# Altium project PCB_Project.PrjPcb (part 1 of 3)
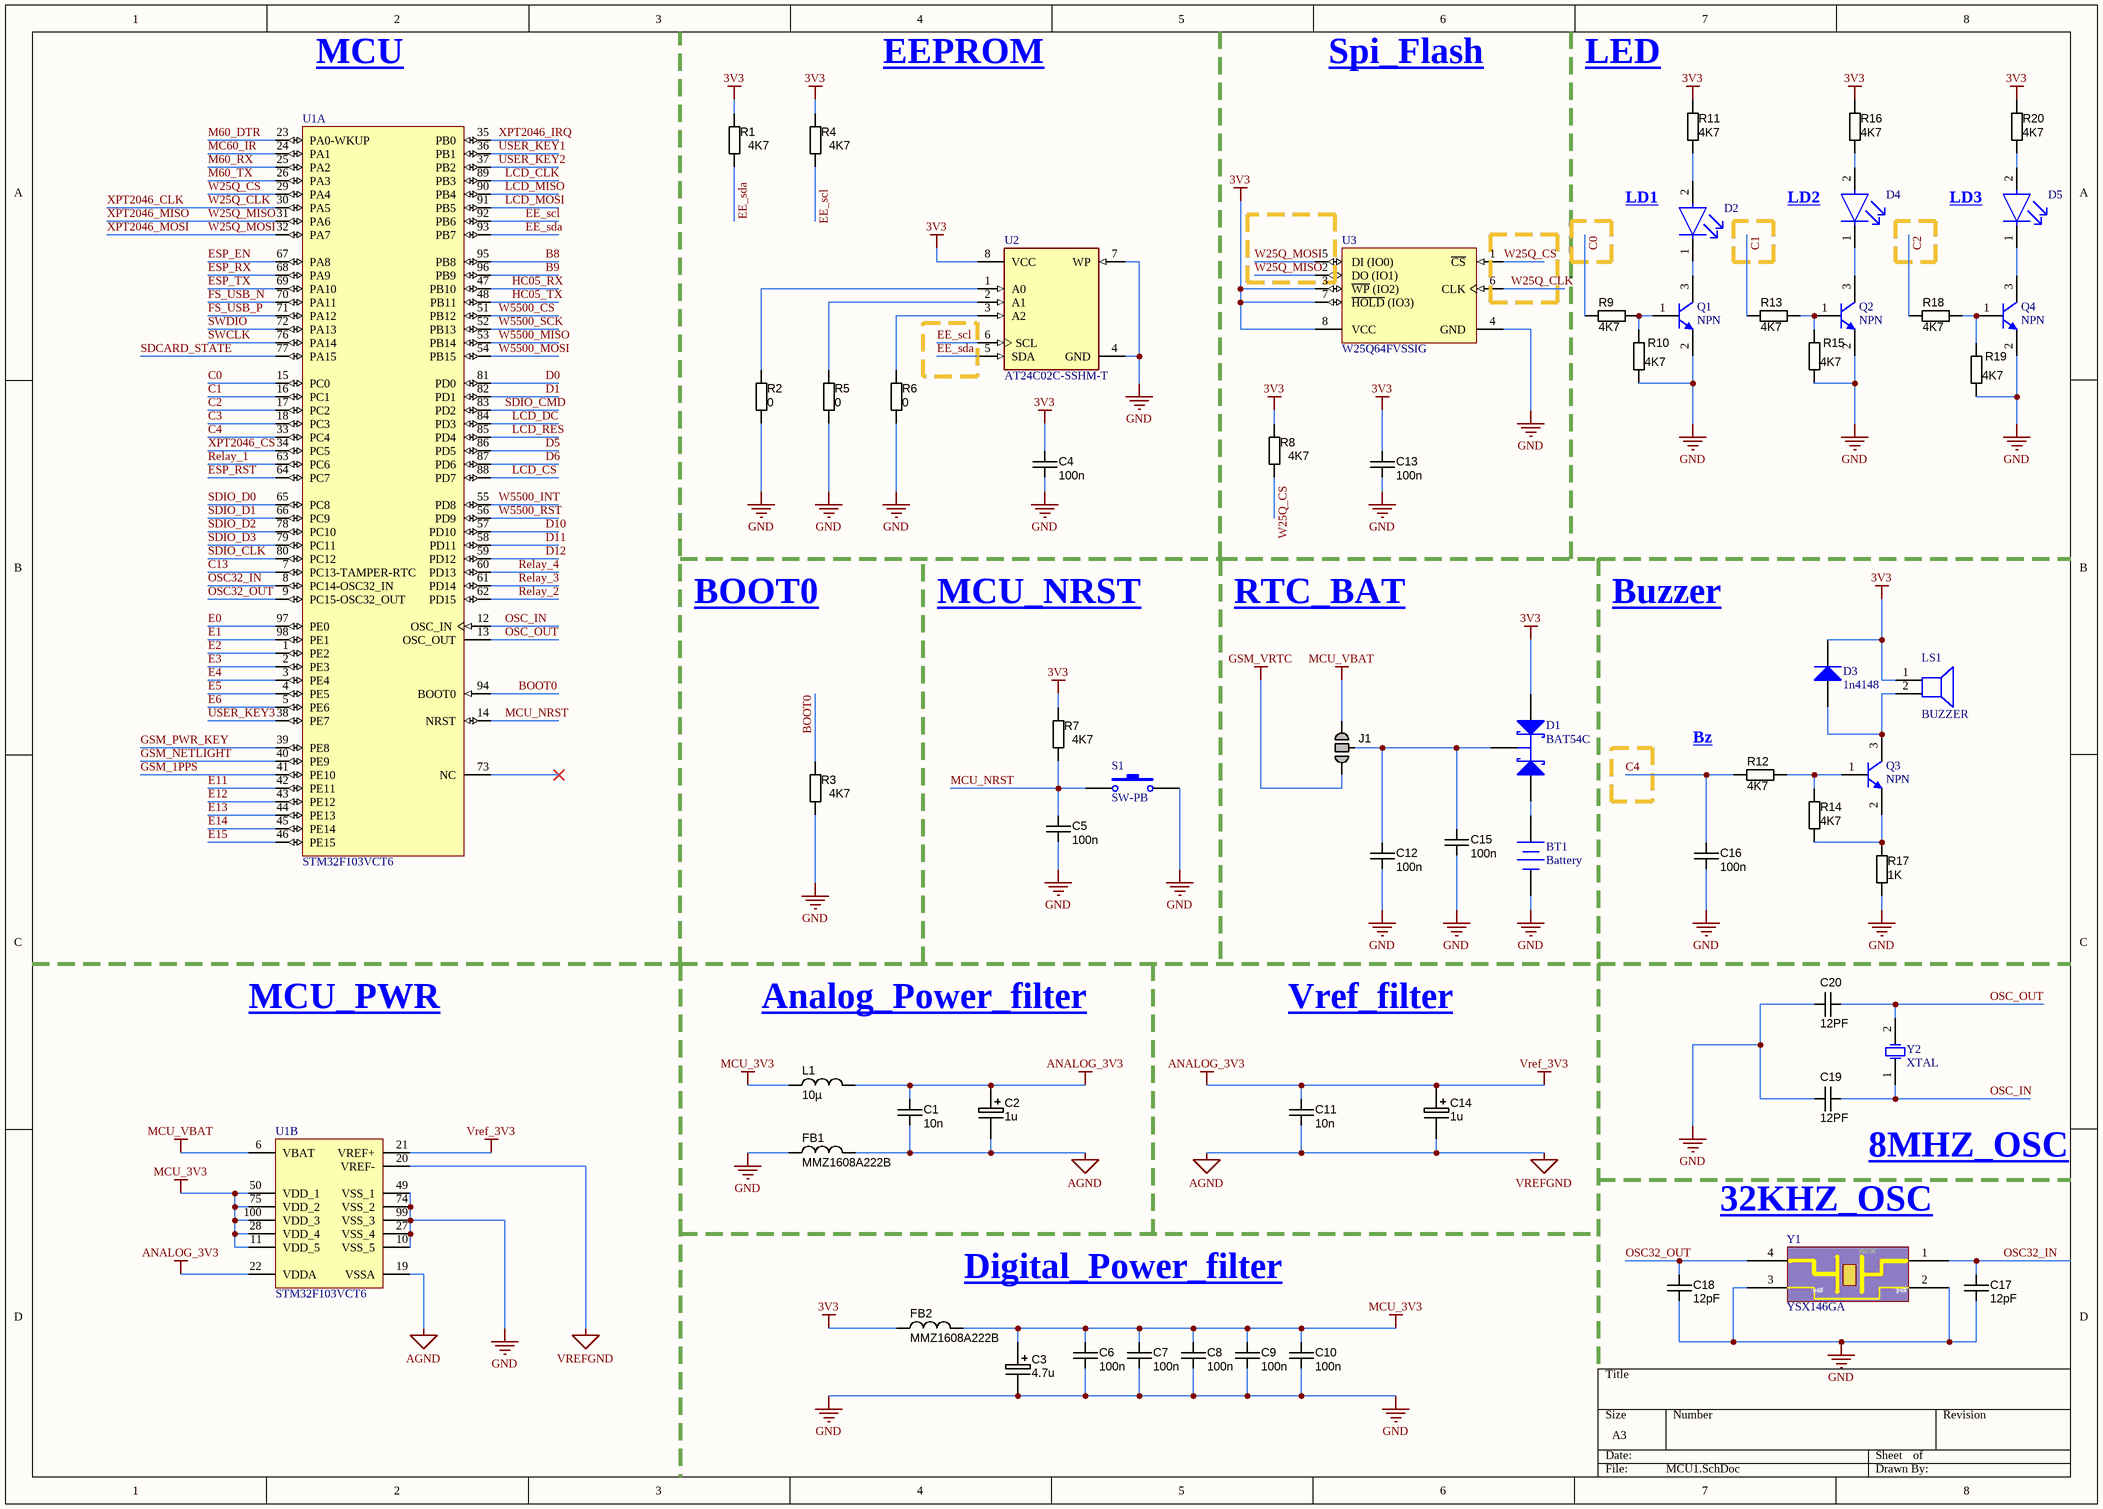
[diagram p0: MCU1.SchDoc]
8 sheets, 365 parts. Net scope: global (net labels, ports and power ports of the same name join across sheets).
Board file: iot_board_pcb.PcbDoc
Sheets:
  MCU1.SchDoc
  Wifi.SchDoc
  W5500.SchDoc
  MCU3.SchDoc
  MC60.SchDoc
  Power.SchDoc
  MCU4.SchDoc
  MCU2.SchDoc

## Sheet MCU1.SchDoc: "mahdi"
size A3; Date: 19/6/1400; SheetNumber: 1; SheetTotal: 8

### Parts
BT1  Battery  [BTH1220]
C1  value 10n  [CAPC1608X90N]  (hidden comment: approved sub OK)
C2  value 1u  [C_TN_3216]
C3  value 4.7u  [C_TN_3528]
C4  value 100n  [CAPC1608X90N]  (hidden comment: approved sub OK)
C5  value 100n  [CAPC1608X90N]  (hidden comment: approved sub OK)
C6  value 100n  [CAPC1608X90N]  (hidden comment: approved sub OK)
C7  value 100n  [CAPC1608X90N]  (hidden comment: approved sub OK)
C8  value 100n  [CAPC1608X90N]  (hidden comment: approved sub OK)
C9  value 100n  [CAPC1608X90N]  (hidden comment: approved sub OK)
C10  value 100n  [CAPC1608X90N]  (hidden comment: approved sub OK)
C11  value 10n  [CAPC1608X90N]  (hidden comment: approved sub OK)
C12  value 100n  [CAPC1608X90N]  (hidden comment: approved sub OK)
C13  value 100n  [CAPC1608X90N]  (hidden comment: approved sub OK)
C14  value 1u  [C_TN_3216]
C15  value 100n  [C1206]  (hidden comment: approved sub OK)
C16  value 100n  [CAPC1608X90N]  (hidden comment: approved sub OK)
C17  value 12pF  [CAPC1608X90N]  (hidden comment: approved sub OK)
C18  value 12pF  [CAPC1608X90N]  (hidden comment: approved sub OK)
C19  value 12PF  [CAPC1608X90N]  (hidden comment: approved sub OK)
C20  value 12PF  [CAPC1608X90N]  (hidden comment: approved sub OK)
D1  BAT54C  [NXP-SOT23-3_V]
D2  LTST-C191TBKT  [FP-LTST-C191TBKT-MFG]  (value not drawn)
D3  1n4148  [d_sod80]
D4  LTST-C191TBKT  [FP-LTST-C191TBKT-MFG]  (value not drawn)
D5  LTST-C191TBKT  [FP-LTST-C191TBKT-MFG]  (value not drawn)
FB1  Manufacturer Part Number 1: MMZ1608A222B  [FBC1608X95N]  (hidden comment: 2K2 @ 100 MHz)
FB2  Manufacturer Part Number 1: MMZ1608A222B  [FBC1608X95N]  (hidden comment: 2K2 @ 100 MHz)
J1  Jumper  [Jump_3Way]  (value not drawn)  (no BOM)
L1  10µ  [INDC3225X250N]
LS1  BUZZER  [BZ_C12]
Q1  NPN  [SOT23-3]
Q2  NPN  [SOT23-3]
Q3  NPN  [SOT23-3]
Q4  NPN  [SOT23-3]
R1  value 4K7  [RESC1608X55N]  (hidden comment: Thick Film)
R2  value 0  [RESC1608X55N]  (hidden comment: Thick Film)
R3  value 4K7  [RESC1608X55N]  (hidden comment: Thick Film)
R4  value 4K7  [RESC1608X55N]  (hidden comment: Thick Film)
R5  value 0  [RESC1608X55N]  (hidden comment: Thick Film)
R6  value 0  [RESC1608X55N]  (hidden comment: Thick Film)
R7  value 4K7  [RESC1608X55N]  (hidden comment: Thick Film)
R8  value 4K7  [RESC1608X55N]  (hidden comment: Thick Film)
R9  value 4K7  [RESC1608X55N]  (hidden comment: Thick Film)
R10  value 4K7  [RESC1608X55N]  (hidden comment: Thick Film)
R11  value 4K7  [RESC1608X55N]  (hidden comment: Thick Film)
R12  value 4K7  [RESC1608X55N]  (hidden comment: Thick Film)
R13  value 4K7  [RESC1608X55N]  (hidden comment: Thick Film)
R14  value 4K7  [RESC1608X55N]  (hidden comment: Thick Film)
R15  value 4K7  [RESC1608X55N]  (hidden comment: Thick Film)
R16  value 4K7  [RESC1608X55N]  (hidden comment: Thick Film)
R17  value 1K  [RESC1608X55N]  (hidden comment: Thick Film)
R18  value 4K7  [RESC1608X55N]  (hidden comment: Thick Film)
R19  value 4K7  [RESC1608X55N]  (hidden comment: Thick Film)
R20  value 4K7  [RESC1608X55N]  (hidden comment: Thick Film)
S1  SW-PB  [SWPBS_SPST_6X3X5]
U1  STM32F103VCT6  [STM-LQFP100_L]  (parts A,B of 2)
U2  AT24C02C-SSHM-T  [FP-C04-057-SN-MFG]
U3  W25Q64FVSSIG  [WINB-SOIC-8_M]
Y1  YSX146GA  [YSX146GA-32.768xTAL]
Y2  XTAL  [XTL_2_5032]

### Nets
3V3: C4.1 C13.1 D1.2(A) D3.2(K) FB2.1 LS1.1 R1.1 R4.1 R7.1 R8.1 R11.2 R16.2 R20.2 U2.8(VCC) U3.3(~{WP}_(IO2)) U3.7(~{HOLD}_(IO3)) U3.8(VCC)
AGND: C1.2 C2.2 C11.2 C14.2 FB1.2 U1.19(VSSA) U1.20(VREF-)  [also labelled VREFGND]
ANALOG_3V3: C1.1 C2.1 C11.1 C14.1 L1.2 U1.21(VREF+) U1.22(VDDA)  [also labelled Vref_3V3]
GND: BT1.2(-) C3.2 C4.2 C5.2 C6.2 C7.2 C8.2 C9.2 C10.2 C12.2 C13.2 C15.2 C16.2 C17.1 C18.1 C19.1 C20.1 FB1.1 Q1.2(E) Q2.2(E) Q4.2(E) R2.1 R3.2 R5.1 R6.1 R10.1 R15.1 R17.2 R19.1 S1.2 U1.10(VSS_5) U1.27(VSS_4) U1.49(VSS_1) U1.74(VSS_2) U1.99(VSS_3) U2.4(GND) U2.7(WP) U3.4(GND) Y1.2 Y1.3
GSM_VRTC: J1.1
MCU_3V3: C3.1 C6.1 C7.1 C8.1 C9.1 C10.1 FB2.2 L1.1 U1.11(VDD_5) U1.28(VDD_4) U1.50(VDD_1) U1.75(VDD_2) U1.100(VDD_3)
MCU_VBAT: J1.3 U1.6(VBAT)
B8: U1.95(PB8)
B9: U1.96(PB9)
BOOT0: R3.1 U1.94(BOOT0)
C0: R9.1 U1.15(PC0)
C1: R13.1 U1.16(PC1)
C2: R18.1 U1.17(PC2)
C3: U1.18(PC3)
C4: C16.1 R12.1 U1.33(PC4)
C13: U1.7(PC13-TAMPER-RTC)
D0: U1.81(PD0)
D1: U1.82(PD1)
D5: U1.86(PD5)
D6: U1.87(PD6)
D10: U1.57(PD10)
D11: U1.58(PD11)
D12: U1.59(PD12)
E0: U1.97(PE0)
E1: U1.98(PE1)
E2: U1.1(PE2)
E3: U1.2(PE3)
E4: U1.3(PE4)
E5: U1.4(PE5)
E6: U1.5(PE6)
E11: U1.42(PE11)
E12: U1.43(PE12)
E13: U1.44(PE13)
E14: U1.45(PE14)
E15: U1.46(PE15)
EE_scl: R4.2 U1.92(PB6) U2.6(SCL)
EE_sda: R1.2 U1.93(PB7) U2.5(SDA)
ESP_EN: U1.67(PA8)
ESP_RST: U1.64(PC7)
ESP_RX: U1.68(PA9)
ESP_TX: U1.69(PA10)
FS_USB_N: U1.70(PA11)
FS_USB_P: U1.71(PA12)
GSM_1PPS: U1.41(PE10)
GSM_NETLIGHT: U1.40(PE9)
GSM_PWR_KEY: U1.39(PE8)
HC05_RX: U1.47(PB10)
HC05_TX: U1.48(PB11)
LCD_CLK: U1.89(PB3)
LCD_CS: U1.88(PD7)
LCD_DC: U1.84(PD3)
LCD_MISO: U1.90(PB4)
LCD_MOSI: U1.91(PB5)
LCD_RES: U1.85(PD4)
M60_DTR: U1.23(PA0-WKUP)
M60_RX: U1.25(PA2)
M60_TX: U1.26(PA3)
MC60_IR: U1.24(PA1)
MCU_NRST: C5.1 R7.2 S1.1 U1.14(NRST)
OSC32_IN: C17.2 U1.8(PC14-OSC32_IN) Y1.1
OSC32_OUT: C18.2 U1.9(PC15-OSC32_OUT) Y1.4
OSC_IN: C19.2 U1.12(OSC_IN) Y2.1(OSC1)
OSC_OUT: C20.2 U1.13(OSC_OUT) Y2.2(OSC2)
Relay_1: U1.63(PC6)
Relay_2: U1.62(PD15)
Relay_3: U1.61(PD14)
Relay_4: U1.60(PD13)
SDCARD_STATE: U1.77(PA15)
SDIO_CLK: U1.80(PC12)
SDIO_CMD: U1.83(PD2)
SDIO_D0: U1.65(PC8)
SDIO_D1: U1.66(PC9)
SDIO_D2: U1.78(PC10)
SDIO_D3: U1.79(PC11)
SWCLK: U1.76(PA14)
SWDIO: U1.72(PA13)
USER_KEY1: U1.36(PB1)
USER_KEY2: U1.37(PB2)
USER_KEY3: U1.38(PE7)
W25Q_CLK: U1.30(PA5) U3.6(CLK)  [also labelled XPT2046_CLK]
W25Q_CS: R8.2 U1.29(PA4) U3.1(~{CS})
W25Q_MISO: U1.31(PA6) U3.2(DO_(IO1))  [also labelled XPT2046_MISO]
W25Q_MOSI: U1.32(PA7) U3.5(DI_(IO0))  [also labelled XPT2046_MOSI]
W5500_CS: U1.51(PB12)
W5500_INT: U1.55(PD8)
W5500_MISO: U1.53(PB14)
W5500_MOSI: U1.54(PB15)
W5500_RST: U1.56(PD9)
W5500_SCK: U1.52(PB13)
XPT2046_CS: U1.34(PC5)
XPT2046_IRQ: U1.35(PB0)
NetBT1_1: BT1.1(+) D1.1(A)
NetC12_1: C12.1 C15.1 D1.3(K) J1.2
NetD2_1: D2.1(C) Q1.3(C)
NetD2_2: D2.2(A) R11.1
NetD3_1: D3.1(A) LS1.2 Q3.3(C)
NetD4_1: D4.1(C) Q2.3(C)
NetD4_2: D4.2(A) R16.1
NetD5_1: D5.1(C) Q4.3(C)
NetD5_2: D5.2(A) R20.1
NetQ1_1: Q1.1(B) R9.2 R10.2
NetQ2_1: Q2.1(B) R13.2 R15.2
NetQ3_1: Q3.1(B) R12.2 R14.2
NetQ3_2: Q3.2(E) R14.1 R17.1
NetQ4_1: Q4.1(B) R18.2 R19.2
NetR2_2: R2.2 U2.1(A0)
NetR5_2: R5.2 U2.2(A1)
NetR6_2: R6.2 U2.3(A2)

Not connected (* = marked no-connect by the designer): U1 73(NC)*

### Notes on the sheet
- MCU
- EEPROM
- Spi_Flash
- LED
- LD1
- LD2
- LD3
- BOOT0
- MCU_NRST
- RTC_BAT
- Buzzer
- (near R12) Bz
- MCU_PWR
- Analog_Power_filter
- Vref_filter
- 8MHZ_OSC
- (near Y1) 32KHZ_OSC
- Digital_Power_filter
- (in symbol YSX146GA) 32.768; gnd

### Library data of the parts
BT1 = Battery: Multicell Battery; Published: 24-Mar-1999; LatestRevisionDate: 17-Jul-2002; LatestRevisionNote: Re-released for DXP Platform.; PackageReference: BAT-2; Publisher: Altium Limited; PackageDescription: Battery; 2 Leads
C1 C4-C13 C15 C16 = CAPC_100n_0603_X7R_50V_10%: Capacitor SMD Cer 100nF 10% 50V X7R 0603; Manufacturer 1: AVX Corporation; Manufacturer Part Number 1: 06035C104KAT2A; Ratings: 50V; X7R; Material: ceramic; SCDType: spec; Manufacturer 2: TDK Corporation; Manufacturer Part Number 2: C1608X7R1H104K; Package / Case: 0603 (1608 Metric); Tolerance: ±10%; Supplier 1: Digi-Key; Supplier Part Number 1: 478-5052-1-ND; ComponentLink1URL: http://www.avx.com/docs/Catalogs/cx7r.pdf; ComponentLink1Description: http://www.avx.com/docs/Catalogs/cx7r.pdf; Supplier 2: Digi-Key; Supplier Part Number 2: 445-1314-1-ND; ComponentLink2URL: http://product.tdk.com/capacitor/mlcc/en/documents/mlcc_commercial_general_en.pdf; ComponentLink2Description: http://product.tdk.com/capacitor/mlcc/en/documents/mlcc_commercial_general_en.pdf
C2 C3 C14 = CAPT_4u7_3216_16V: Capacitor SMD Tantalum 10uF 10% 16V 3216-18; Manufacturer 1: Vishay/Sprague; Manufacturer Part Number 1: 293D475X9016A2TE3; SCDType: undef; Package / Case: EIA 535BAAC size A; Ratings: 16V; Tolerance: ±10%; Material: Tantalum; Supplier 1: Digi-Key; Supplier Part Number 1: 718-1148-1-ND
C17 C18 = CAPC_100n_0603_X7R_50V_10%: Capacitor SMD Cer 6.8PF 10% 50V X7R 0603; Manufacturer 1: AVX Corporation; Manufacturer Part Number 1: 06035C104KAT2A; Ratings: 50V; X7R; Material: ceramic; SCDType: spec; Manufacturer 2: TDK Corporation; Manufacturer Part Number 2: C1608X7R1H104K; Package / Case: 0603 (1608 Metric); Tolerance: ±10%; Supplier 1: Digi-Key; Supplier Part Number 1: 478-5052-1-ND; ComponentLink1URL: http://www.avx.com/docs/Catalogs/cx7r.pdf; ComponentLink1Description: http://www.avx.com/docs/Catalogs/cx7r.pdf; Supplier 2: Digi-Key; Supplier Part Number 2: 445-1314-1-ND; ComponentLink2URL: http://product.tdk.com/capacitor/mlcc/en/documents/mlcc_commercial_general_en.pdf; ComponentLink2Description: http://product.tdk.com/capacitor/mlcc/en/documents/mlcc_commercial_general_en.pdf
C19 C20 = CAPC_100n_0603_X7R_50V_10%: Capacitor SMD Cer 20PF10% 50V X7R 0603; Manufacturer 1: AVX Corporation; Manufacturer Part Number 1: 06035C104KAT2A; Tolerance: ±10%; Ratings: 50V; X7R; Material: ceramic; SCDType: spec; Manufacturer 2: TDK Corporation; Manufacturer Part Number 2: C1608X7R1H104K; Package / Case: 0603 (1608 Metric); Supplier 1: Digi-Key; Supplier Part Number 1: 478-5052-1-ND; ComponentLink1URL: http://www.avx.com/docs/Catalogs/cx7r.pdf; ComponentLink1Description: http://www.avx.com/docs/Catalogs/cx7r.pdf; Supplier 2: Digi-Key; Supplier Part Number 2: 445-1314-1-ND; ComponentLink2URL: http://product.tdk.com/capacitor/mlcc/en/documents/mlcc_commercial_general_en.pdf; ComponentLink2Description: http://product.tdk.com/capacitor/mlcc/en/documents/mlcc_commercial_general_en.pdf
D1 = CMP-0417-00003-1: Schottky Barrier Diode, 30 V, 2 uA, -55 to 150 degC, 3-Pin SOT23, RoHS, Tape and Reel; Manufacturer: NXP Semiconductors; IR (uA): 2; VF (mV): 800; Trr (ns): 5; Cd (pF): 10; VR (V): 30; Rth(j-a) (K/W): 500; RoHS: TRUE; Packing: Tape and Reel; ComponentLink2URL: http://www.nxp.com/documents/data_sheet/BAT54_SER.pdf; PartNumber: BAT54C; ComponentLink2Description: Datasheet; Temperature Range: -55 to 150 degC; PackageReference: SOT23-3; PackageDescription: 3-Pin Plastic Surface-mounted Package, Body 1.3 x 2.9 mm, Pitch 0.95 mm; Mounting Technology: Surface Mount; ComponentLink1URL: http://www.nxp.com/; DatasheetVersion: Rev. 5; ComponentLink1Description: Manufacturer URL
D2 D4 D5 = CMP-22017-000008-1: LED BLUE CLEAR CHIP SMD; Lens Color: Colorless; Dominant Wavelength: 475nm; Forward Current: 20mA; Wavelength: 468nm; Viewing Angle: 130°; Power Dissipation: 76mW; Luminous Intensity: 180mcd; Reverse Voltage: 5V; Number of Elements: 1; Lens Style: Diffused; Forward Voltage: 3.8V; Max Power Dissipation: 75mW; Case Code (Metric): 1608; Packaging: Tape and Reel; Case/Package: 0603; Depth: 1.6mm; Mount: Surface Mount; Lead Free: Lead Free; Min Operating Temperature: -20°C; Lens Transparency: Clear; Illumination Color: Blue; Height: 0.55mm; Test Current: 20mA; Case Code (Imperial): 0603; Max Operating Temperature: 80°C; Number of Pins: 2; Length: 0.8mm; Radiation Hardening: No; Package Quantity: 1; Number of LEDs: 1; Width: 0.8mm; Color: Blue
D3 = Diode: Default Diode; Published: 8-Jun-2000; LatestRevisionDate: 17-Jul-2002; LatestRevisionNote: Re-released for DXP Platform.; PackageVersion: Sep-1996; PackageReference: SMC; Publisher: Altium Limited; PackageDescription: DO-214-AB/SMC; 2 C-Bend Leads; Body 7.9 x 5.9 mm, inc. leads (LxW); Code_JEDEC: DO-214-AB
FB1 FB2 = FERRITE_2K2-100MHz_0603: Ferrite bead 2.2K Ohm at 100 MHz 200mA 0603 SMD; Manufacturer 1: TDK Corporation; Ratings: 200 mA; 800 mOhm DC; Impedance @ Frequency: 2200 Ohm @ 100MHz; DC Resistance (DCR): 800 mOhm Max; Filter Type: Differential Mode - Single; SCDType: source; Size / Dimension: 0.063" L x 0.031" W (1.60mm x 0.80mm); Current Rating: 200mA; Package / Case: 0603 (1608 Metric); Height (Max): 0.037" (0.95mm); Mounting Type: Surface Mount; Supplier 1: Digi-Key; Supplier Part Number 1: 445-8671-1-ND; RoHS 1: RoHS Compliant; ComponentLink1URL: http://www.tdk.co.jp/tefe02/e9412_mmz.pdf; ComponentLink1Description: http://www.tdk.co.jp/tefe02/e9412_mmz.pdf; Value: 2K2 @ 100 MHz
J1 = JUMP_3WAY: SMD jumper
L1 = INDC_10u_LowRDC: Inductor SMD Low DCR 10 µH 900mA 20% 1210; Manufacturer 1: Taiyo Yuden; Manufacturer Part Number 1: CBC3225T100MR; Ratings: 900 mA; 133 mOhm; DC Resistance (DCR): 172.9 mOhm Max; Frequency - Self Resonant: 23MHz; Frequency - Test: 100kHz; SCDType: spec; Tolerance: ±20%; Supplier 1: Digi-Key; Supplier Part Number 1: 587-1625-1-ND; Current: 900mA; Current - Saturation: 900mA; Current - Temperature Rise: 900mA; Applications: Power Supplies; Package / Case: 1210 (3225 Metric); Operating Temperature: -40°C ~ 105°C; ComponentLink1URL: http://www.yuden.co.jp/ut/product/pdf/wound02_e.pdf; ComponentLink1Description: http://www.yuden.co.jp/ut/product/pdf/wound02_e.pdf; Value: 10µ
LS1 = Speaker: Loudspeaker; Published: 24-Mar-1999; LatestRevisionDate: 17-Jul-2002; LatestRevisionNote: Re-released for DXP Platform.; PackageReference: PIN2; Publisher: Altium Limited
Q1-Q4 = NPN: NPN Bipolar Transistor; Published: 8-Jun-2000; LatestRevisionDate: 17-Jul-2002; LatestRevisionNote: Re-released for DXP Platform.; PackageReference: TO-226-AA; Publisher: Altium Limited; PackageDescription: TO, Flat Index; 3 In-Line, Axial Leads; Body Dia. 4.8mm; Leads 0.55 x 0.51 mm (max); Code_JEDEC: TO-226-AA
R1 R3 R4 R7-R20 = RES_4K7_0603_5%: Resistor SMD chip 4.7k Ohm 0.1W 5% 0603; Manufacturer 1: Vishay/Dale; Manufacturer Part Number 1: CRCW06034K70JNEA; Ratings: 1/10 W; SCDType: spec; Package / Case: 0603 (1608 metric); Tolerance: ±5%; Material: Thick Film; Supplier 1: Digi-Key; Supplier Part Number 1: 541-4.7KGCT-ND
R2 R5 R6 = RES_4K7_0603_5%: Resistor SMD chip 0 Ohm 0.1W 5% 0603; Manufacturer 1: Vishay/Dale; Manufacturer Part Number 1: CRCW06034K70JNEA; Ratings: 1/10 W; SCDType: spec; Package / Case: 0603 (1608 metric); Tolerance: ±5%; Material: Thick Film; Supplier 1: Digi-Key; Supplier Part Number 1: 541-4.7KGCT-ND
S1 = SW-PB: Switch; Published: 24-Mar-1999; LatestRevisionDate: 17-Jul-2002; LatestRevisionNote: Re-released for DXP Platform.; PackageReference: SPST-2; Publisher: Altium Limited; PackageDescription: Switch; 2 Leads
U1 = CMP-0237-00164-3: ARM Cortex-M3 32-bit MCU, 256 KB Flash, 48 KB Internal RAM, 80 I/Os, 100-pin LQFP, -40 to 85 degC, Tray; FLASH Size (Prog) (kB): 256; I/Os (High Current): 80; Supply Voltage(Vcc) min (V): 2; Operating Frequency(F) (Processor speed) (MHz): 72; Internal RAM Size (kB): 48; A/D Converter: 3x12-bit (16 Channel); D/A Converter: 2x12-bit (2 Channel); PartNumber: STM32F103VCT6; ComponentLink2URL: http://www.st.com/st-web-ui/static/active/en/resource/technical/document/datasheet/CD00191185.pdf; Packing: Tray; ComponentLink3Description: Package Specification; PackageReference: LQFP100; ComponentLink1Description: Manufacturer URL; ComponentLink2Description: Datasheet; PackageDescription: 100-Pin Low Profile Quad Flat Package, 14 x 14 mm Body, 0.5 mm Pitch; DatasheetVersion: Rev. 8; Core: ARM Cortex-M3; ComponentLink1URL: http://www.st.com/web/en/home.html; ComponentLink3URL: http://www.st.com/st-web-ui/static/active/en/resource/technical/document/data_brief/DM00071938.pdf; Mounting Technology: Surface Mount; PackageVersion: Rev. 1, 06/2013
U2 = CMP-06313-000008-1: IC EEPROM 2K I2C 1MHZ 8SOIC; Manufacturer: Microchip; Frequency: 1000kHz; Nominal Supply Current: 0.4-2mA; Min Supply Voltage: 1.7V; Standoff Height: 0.1mm; Access Time: 900ns; Memory Size: 2Kbits; Max Supply Voltage: 5.5V; Interface: I2C,2-Wire; Ipc Land Pattern Name: SOIC127P600X175-8; Octopart: https://octopart.com/at24c02c-sshm-t-microchip-77757935; Footprint Url: http://ww1.microchip.com/downloads/en/DeviceDoc/08L_SOIC_150_3dot9mm_SN_C04-00057e.pdf; Temperature Range High: +85°C; Height: 1.75mm; Package: C04-057-SN; RoHS: TRUE; Mouser Description: EEPROM Serial-2Wire 2K-bit 256 x 8 1.8V/2.5V/3.3V/5V Automotive 8-Pin SOIC T/R; Memory Type: EEPROM; Device Class L3: EEPROM; Device Class L2: Memory; ComponentLink2URL: http://ww1.microchip.com/downloads/en/DeviceDoc/AT24C01C-AT24C02C-I2C-Compatible-Two-Wire-Serial-EEPROM-1Kbit-2Kbit-20006111A.pdf; Digikey Description: IC EEPROM 2K I2C 1MHZ 8SOIC; Category: IC; Temperature: -40°C to +85°C; Lead Free: Yes; Manufacturer Part Number: AT24C02C-SSHM-T; ComponentLink2Description: Datasheet; Temperature Range Low: -40°C; Automotive: No; Device Class L1: Integrated Circuits (ICs)
U3 = CMP-2000-05007-1: 3V 64M-Bit Serial Flash Memory with Dual/Quad SPI & QPI, 2.7 to 3.6 V, -40 to 85 degC, 8-Pin SOIC, RoHS, Tape and Reel; Manufacturer: Winbond; Boot Type: Bottom/Top; Word Size: 8b; Cell Type: NOR; Operating Supply Voltage (Min): 2.7V; Operating Supply Voltage (Max): 3.6V; Rad Hardened: No; Density: 67108864Bit; Address Bus: 1b; Supply Current: 40mA; Sync/Async: Synchronous; Number of Words: 8M; Programmable: Yes; Operating Supply Voltage (Typ): 3/3.3V; Access Time (Max): 8.5ns; Interface Type: Serial(SPI); Operating Temperature Classification: Industrial; Datasheet Version: Rev. D, 12/2011; Operating Temp Range: -40Cto85C; Operating Temperature (Max): 85C; Pin Count: 8; Mounting: SurfaceMount; Program/Erase Volt (Typ): 2.7to3.6V; Operating Temperature (Min): -40C; Package Description: 8-Pin Small Outline Integrated Circuit, Body 5.28 x 5.28 mm, Pitch 1.27 mm; Datasheet URL: https://datasheet.ciiva.com/15126/getdatasheetpartid-552937-15126648.pdf; Package Reference: SS-8; Manufacturer URL: http://www.winbond.com/hq/index.html?__locale=en; Package Type: SOIC
Y2 = XTAL: Crystal Oscillator; Published: 8-Jun-2000; LatestRevisionDate: 17-Jul-2002; LatestRevisionNote: Re-released for DXP Platform.; PackageReference: R38; Publisher: Altium Limited; PackageDescription: Crystal, Thru-Hole; 2 Leads; Body 3.1 x 8.2 mm (Dia.xH)

## Sheet Wifi.SchDoc
size A4; SheetNumber: 2; SheetTotal: 8
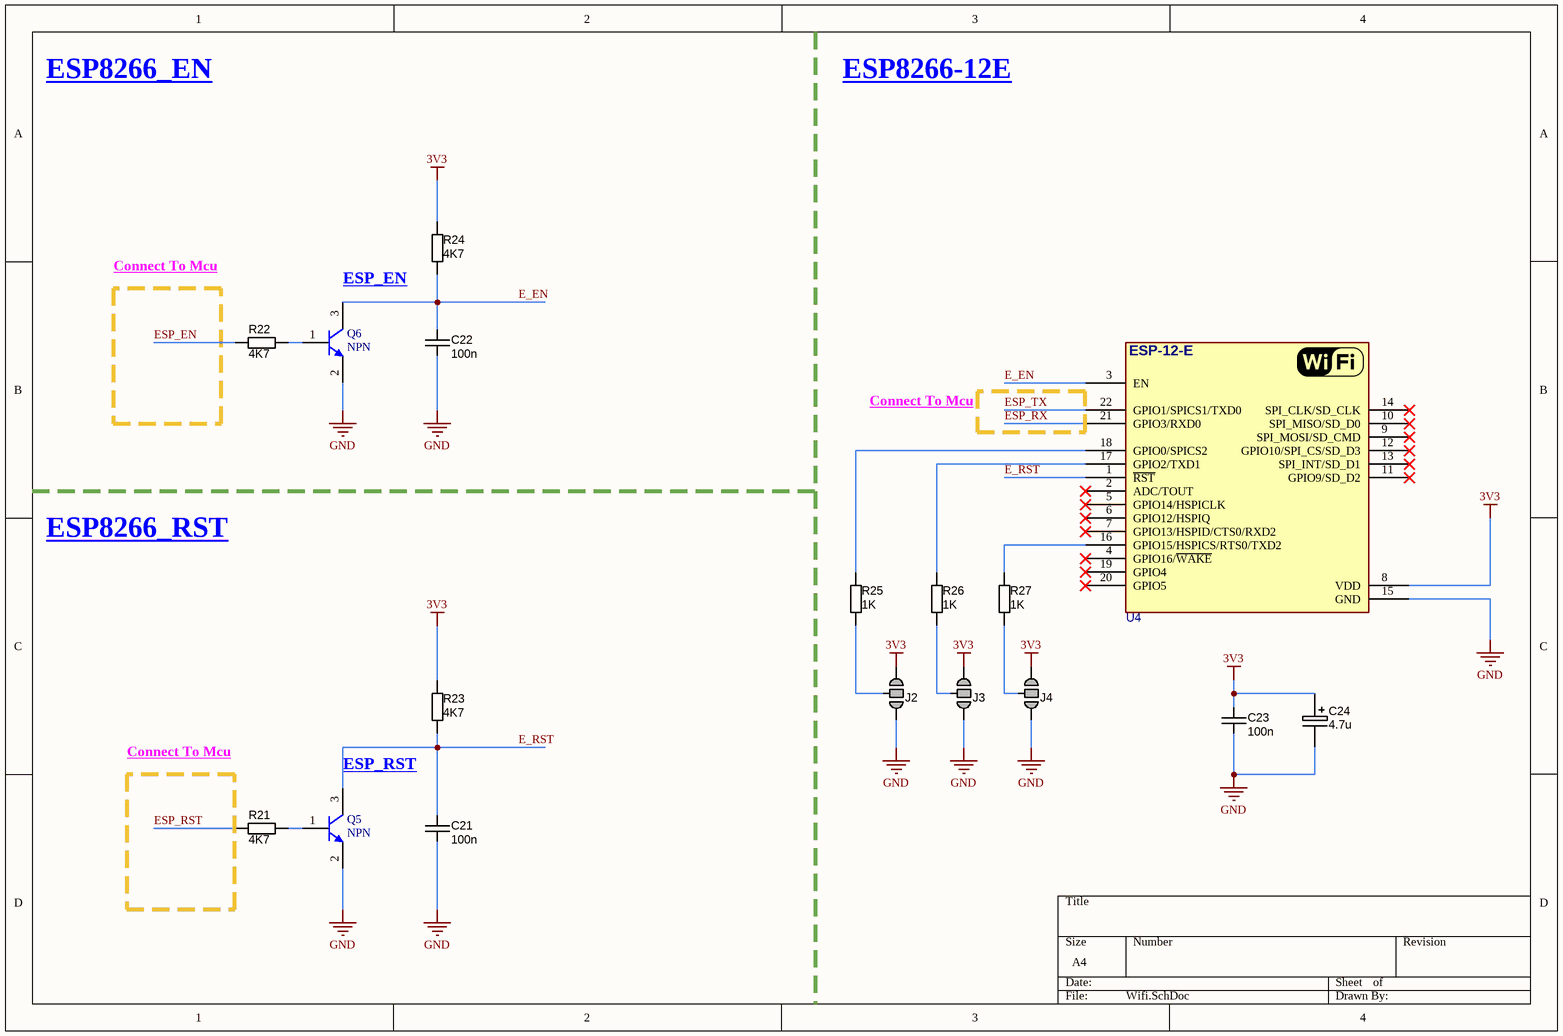
[diagram p1: Wifi.SchDoc]

### Parts
C21  value 100n  [CAPC1608X90N]  (hidden comment: approved sub OK)
C22  value 100n  [CAPC1608X90N]  (hidden comment: approved sub OK)
C23  value 100n  [CAPC1608X90N]  (hidden comment: approved sub OK)
C24  value 4.7u  [C_TN_3528]
J2  Jumper  [Jump_3Way]  (value not drawn)  (no BOM)
J3  Jumper  [Jump_3Way]  (value not drawn)  (no BOM)
J4  Jumper  [Jump_3Way]  (value not drawn)  (no BOM)
Q5  NPN  [SOT23-3]
Q6  NPN  [SOT23-3]
R21  value 4K7  [RESC1608X55N]  (hidden comment: Thick Film)
R22  value 4K7  [RESC1608X55N]  (hidden comment: Thick Film)
R23  value 4K7  [RESC1608X55N]  (hidden comment: Thick Film)
R24  value 4K7  [RESC1608X55N]  (hidden comment: Thick Film)
R25  value 1K  [RESC1608X55N]  (hidden comment: Thick Film)
R26  value 1K  [RESC1608X55N]  (hidden comment: Thick Film)
R27  value 1K  [RESC1608X55N]  (hidden comment: Thick Film)
U4  (no value)  [ESP8266_ESP12E]

### Nets
3V3: C23.1 C24.1 J2.3 J3.3 J4.3 R23.1 R24.1 U4.8(VDD)
GND: C21.2 C22.2 C23.2 C24.2 J2.1 J3.1 J4.1 Q5.2(E) Q6.2(E) U4.15(GND)
E_EN: C22.1 Q6.3(C) R24.2 U4.3(EN)
E_RST: C21.1 Q5.3(C) R23.2 U4.1(~{RST})
ESP_EN: R22.1
ESP_RST: R21.1
ESP_RX: U4.21(GPIO3/RXD0)
ESP_TX: U4.22(GPIO1/SPICS1/TXD0)
NetJ2_2: J2.2 R25.2
NetJ3_2: J3.2 R26.2
NetJ4_2: J4.2 R27.2
NetQ5_1: Q5.1(B) R21.2
NetQ6_1: Q6.1(B) R22.2
NetR25_1: R25.1 U4.18(GPIO0/SPICS2)
NetR26_1: R26.1 U4.17(GPIO2/TXD1)
NetR27_1: R27.1 U4.16(GPIO15/HSPICS/RTS0/TXD2)

Not connected (* = marked no-connect by the designer): U4 2(ADC/TOUT)* 4(GPIO16/~{WAKE})* 5(GPIO14/HSPICLK)* 6(GPIO12/HSPIQ)* 7(GPIO13/HSPID/CTS0/RXD2)* 9(SPI_MOSI/SD_CMD)* 10(SPI_MISO/SD_D0)* 11(GPIO9/SD_D2)* 12(GPIO10/SPI_CS/SD_D3)* 13(SPI_INT/SD_D1)* 14(SPI_CLK/SD_CLK)* 19(GPIO4)* 20(GPIO5)*

### Notes on the sheet
- ESP8266_EN
- ESP8266-12E
- Connect To Mcu
- ESP_EN
- ESP8266_RST
- ESP_RST
- (in symbol ESP8266 ESP-12-E) ESP-12-E

### Library data of the parts
C21-C23 = CAPC_100n_0603_X7R_50V_10%: as C1 on sheet MCU1; Manufacturer 2: TDK Corporation; Manufacturer Part Number 2: C1608X7R1H104K; Package / Case: 0603 (1608 Metric); Tolerance: ±10%; Supplier 1: Digi-Key; Supplier Part Number 1: 478-5052-1-ND; ComponentLink1URL: http://www.avx.com/docs/Catalogs/cx7r.pdf; ComponentLink1Description: http://www.avx.com/docs/Catalogs/cx7r.pdf; Supplier 2: Digi-Key; Supplier Part Number 2: 445-1314-1-ND; ComponentLink2URL: http://product.tdk.com/capacitor/mlcc/en/documents/mlcc_commercial_general_en.pdf; ComponentLink2Description: http://product.tdk.com/capacitor/mlcc/en/documents/mlcc_commercial_general_en.pdf
C24 = CAPT_4u7_3216_16V: as C2 on sheet MCU1; Package / Case: EIA 535BAAC size A; Ratings: 16V; Tolerance: ±10%; Material: Tantalum; Supplier 1: Digi-Key; Supplier Part Number 1: 718-1148-1-ND
J2-J4 = JUMP_3WAY: SMD jumper
Q5 Q6 = NPN: NPN Bipolar Transistor; Published: 8-Jun-2000; LatestRevisionDate: 17-Jul-2002; LatestRevisionNote: Re-released for DXP Platform.; PackageReference: TO-226-AA; Publisher: Altium Limited; PackageDescription: TO, Flat Index; 3 In-Line, Axial Leads; Body Dia. 4.8mm; Leads 0.55 x 0.51 mm (max); Code_JEDEC: TO-226-AA
R21-R24 = RES_4K7_0603_5%: as R1 on sheet MCU1; Package / Case: 0603 (1608 metric); Tolerance: ±5%; Material: Thick Film; Supplier 1: Digi-Key; Supplier Part Number 1: 541-4.7KGCT-ND
R25-R27 = RES_4K7_0603_5%: Resistor SMD chip 1k Ohm 0.1W 5% 0603; Manufacturer 1: Vishay/Dale; Manufacturer Part Number 1: CRCW06034K70JNEA; Ratings: 1/10 W; SCDType: spec; Package / Case: 0603 (1608 metric); Tolerance: ±5%; Material: Thick Film; Supplier 1: Digi-Key; Supplier Part Number 1: 541-4.7KGCT-ND
U4 = ESP8266 ESP-12-E: ESP8266 ESP-12 Wi-Fi Module; ComponentLink1Description: Website Smart World; ComponentLink1URL: https://www.smartw.ir/; DatasheetVersion: 2021; ComponentLink2Description: Telegram; ComponentLink2URL: https://t.me/altium_smartw; ComponentLink3Description: Instagram; ComponentLink3URL: https://Instagram.com/smartgw.ir

## Sheet W5500.SchDoc
size A3; SheetNumber: 3; SheetTotal: 8
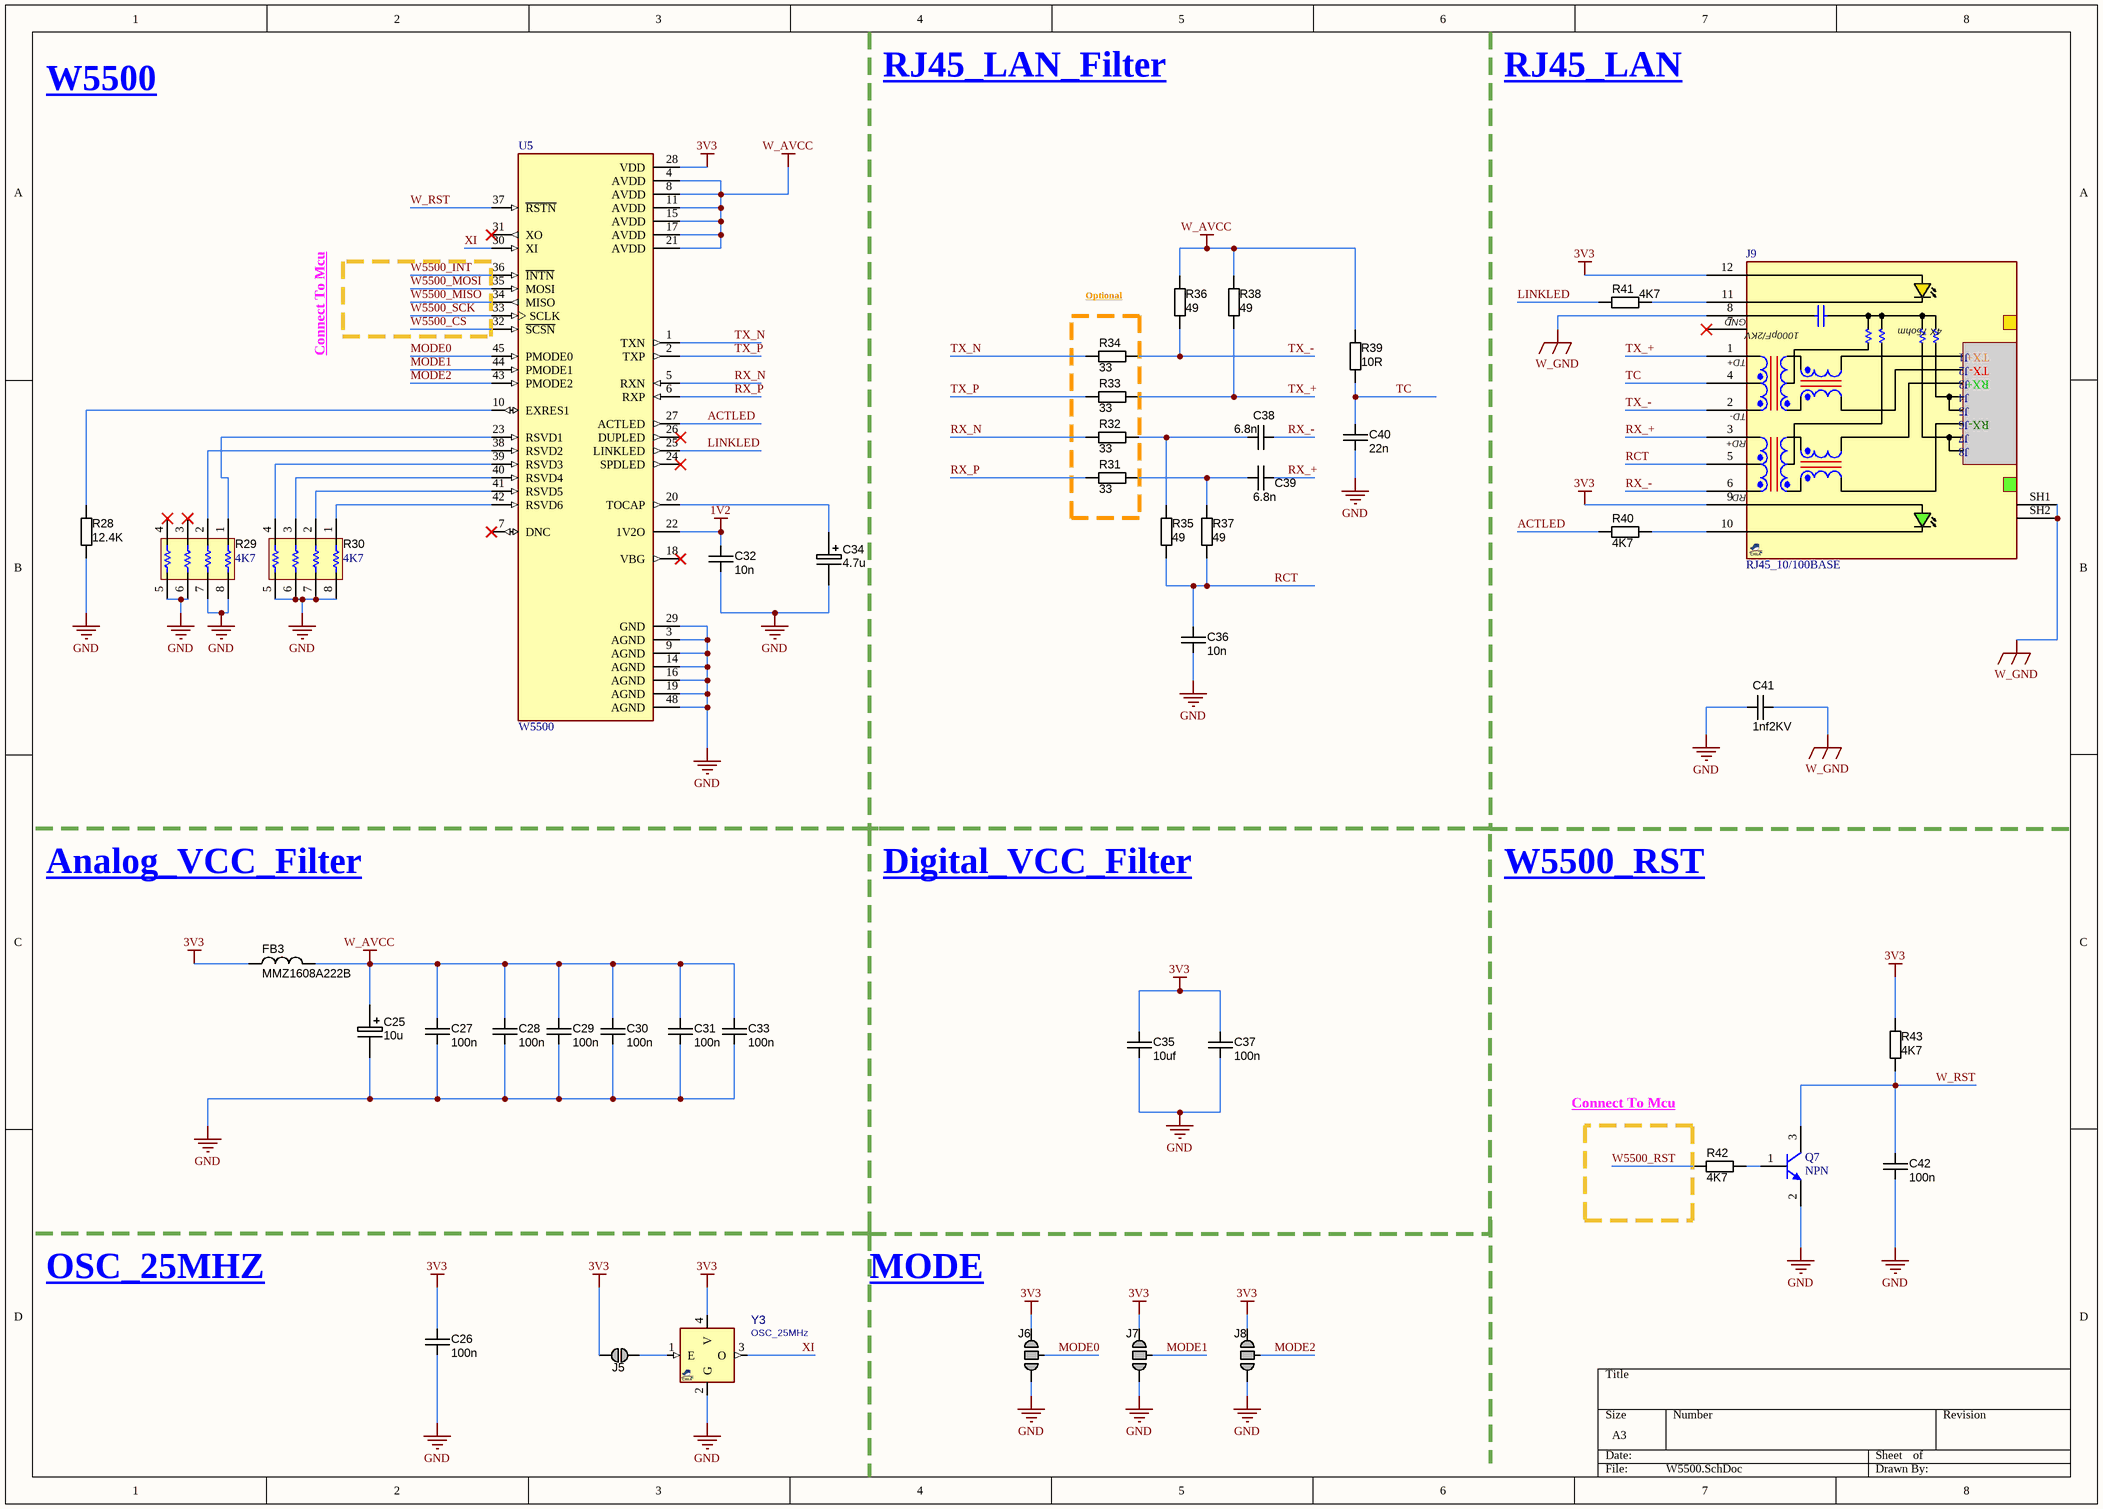
[diagram p2: W5500.SchDoc]

### Parts
C25  value 10u  [C_TN_3216]
C26  value 100n  [CAPC1608X90N]  (hidden comment: approved sub OK)
C27  value 100n  [CAPC1608X90N]  (hidden comment: approved sub OK)
C28  value 100n  [CAPC1608X90N]  (hidden comment: approved sub OK)
C29  value 100n  [CAPC1608X90N]  (hidden comment: approved sub OK)
C30  value 100n  [CAPC1608X90N]  (hidden comment: approved sub OK)
C31  value 100n  [CAPC1608X90N]  (hidden comment: approved sub OK)
C32  value 10n  [CAPC1608X90N]  (hidden comment: approved sub OK)
C33  value 100n  [CAPC1608X90N]  (hidden comment: approved sub OK)
C34  value 4.7u  [C_TN_3216]
C35  value 10uf  [CAPC1608X90N]  (hidden comment: approved sub OK)
C36  value 10n  [CAPC1608X90N]  (hidden comment: approved sub OK)
C37  value 100n  [CAPC1608X90N]  (hidden comment: approved sub OK)
C38  value 6.8n  [CAPC1608X90N]  (hidden comment: approved sub OK)
C39  value 6.8n  [CAPC1608X90N]  (hidden comment: approved sub OK)
C40  value 22n  [CAPC1608X90N]  (hidden comment: approved sub OK)
C41  value 1nf2KV  [C1206]  (hidden comment: approved sub OK)
C42  value 100n  [CAPC1608X90N]  (hidden comment: approved sub OK)
FB3  Manufacturer Part Number 1: MMZ1608A222B  [FBC1608X95N]  (hidden comment: 2K2 @ 100 MHz)
J5  Jumper  [JUMP1]  (value not drawn)  (no BOM)
J6  Jumper  [Jump_3Way]  (value not drawn)  (no BOM)
J7  Jumper  [Jump_3Way]  (value not drawn)  (no BOM)
J8  Jumper  [Jump_3Way]  (value not drawn)  (no BOM)
J9  RJ45_10/100BASE  [RJ45_8M_HR911105A]
Q7  NPN  [SOT23-3]
R28  value 12.4K  [RESC1608X55N]  (hidden comment: Thick Film)
R29  value 4K7  [RP0603X4]  (hidden comment: Resistor Array SMD)
R30  value 4K7  [RP0603X4]  (hidden comment: Resistor Array SMD)
R31  value 33  [RESC1608X55N]  (hidden comment: Thick Film)
R32  value 33  [RESC1608X55N]  (hidden comment: Thick Film)
R33  value 33  [RESC1608X55N]  (hidden comment: Thick Film)
R34  value 33  [RESC1608X55N]  (hidden comment: Thick Film)
R35  value 49  [RESC1608X55N]  (hidden comment: Thick Film)
R36  value 49  [RESC1608X55N]  (hidden comment: Thick Film)
R37  value 49  [RESC1608X55N]  (hidden comment: Thick Film)
R38  value 49  [RESC1608X55N]  (hidden comment: Thick Film)
R39  value 10R  [RESC1608X55N]  (hidden comment: Thick Film)
R40  value 4K7  [RESC1608X55N]  (hidden comment: Thick Film)
R41  value 4K7  [RESC1608X55N]  (hidden comment: Thick Film)
R42  value 4K7  [RESC1608X55N]  (hidden comment: Thick Film)
R43  value 4K7  [RESC1608X55N]  (hidden comment: Thick Film)
U5  W5500  [LQFP-48_N]
Y3  OSC_25MHz  [XTL_4_2520]

### Blocks framed on the sheet
Optional: R31-R34

### Nets
1V2: C32.1 U5.22(1V2O)
3V3: C26.1 C35.1 C37.1 FB3.1 J5.2 J6.3 J7.3 J8.3 J9.9(GLED+) J9.12(YLED+) R43.1 U5.28(VDD) Y3.4(V)
GND: C25.2 C26.2 C27.2 C28.2 C29.2 C30.2 C31.2 C32.2 C33.2 C34.2 C35.2 C36.2 C37.2 C40.2 C41.1 C42.2 J6.1 J7.1 J8.1 Q7.2(E) R28.1 R29.5 R29.6 R29.7 R29.8 R30.5 R30.6 R30.7 R30.8 U5.3(AGND) U5.9(AGND) U5.14(AGND) U5.16(AGND) U5.19(AGND) U5.29(GND) U5.48(AGND) Y3.2(G)
W_AVCC: C25.1 C27.1 C28.1 C29.1 C30.1 C31.1 C33.1 FB3.2 R36.2 R38.2 R39.2 U5.4(AVDD) U5.8(AVDD) U5.11(AVDD) U5.15(AVDD) U5.17(AVDD) U5.21(AVDD)
W_GND: C41.2 J9.8(CHSGND) J9.SH1 J9.SH2
ACTLED: R40.1 U5.27(ACTLED)
LINKLED: R41.1 U5.25(LINKLED)
MODE0: J6.2 U5.45(PMODE0)
MODE1: J7.2 U5.44(PMODE1)
MODE2: J8.2 U5.43(PMODE2)
RCT: C36.1 J9.5(RCT) R35.1 R37.1
RX_+: C39.2 J9.3(RD+)
RX_-: C38.2 J9.6(RD-)
RX_N: R32.1 U5.5(RXN)
RX_P: R31.1 U5.6(RXP)
TC: C40.1 J9.4(TCT) R39.1
TX_+: J9.1(TD+) R33.2 R38.1
TX_-: J9.2(TD-) R34.2 R36.1
TX_N: R34.1 U5.1(TXN)
TX_P: R33.1 U5.2(TXP)
W5500_CS: U5.32(~{SCSN})
W5500_INT: U5.36(~{INTN})
W5500_MISO: U5.34(MISO)
W5500_MOSI: U5.35(MOSI)
W5500_RST: R42.1
W5500_SCK: U5.33(SCLK)
W_RST: C42.1 Q7.3(C) R43.2 U5.37(~{RSTN})
XI: U5.30(XI) Y3.3(O)
NetC34_1: C34.1 U5.20(TOCAP)
NetC38_1: C38.1 R32.2 R35.2
NetC39_1: C39.1 R31.2 R37.2
NetJ5_1: J5.1 Y3.1(E)
NetJ9_10: J9.10(GLED-) R40.2
NetJ9_11: J9.11(YLED-) R41.2
NetQ7_1: Q7.1(B) R42.2
NetR28_2: R28.2 U5.10(EXRES1)
NetR29_1: R29.1 U5.23(RSVD1)
NetR29_2: R29.2 U5.38(RSVD2)
NetR30_1: R30.1 U5.42(RSVD6)
NetR30_2: R30.2 U5.41(RSVD5)
NetR30_3: R30.3 U5.40(RSVD4)
NetR30_4: R30.4 U5.39(RSVD3)

Not connected (* = marked no-connect by the designer): J9 7(NC)*; R29 3* 4*; U5 7(DNC)* 18(VBG)* 24(SPDLED)* 26(DUPLED)* 31(XO)*

### Notes on the sheet
- W5500
- RJ45_LAN_Filter
- RJ45_LAN
- Connect To Mcu
- Analog_VCC_Filter
- Digital_VCC_Filter
- W5500_RST
- OSC_25MHZ
- MODE
- (in symbol RJ45_HR911105A) GND; 4X 75ohm; 1000pF/2KV; J1; TX+; J2; TX-; J3; RX+; J4; J5; J6; RX-; J7; J8

### Library data of the parts
C25 = CAPT_4u7_3216_16V: as C2 on sheet MCU1; Package / Case: EIA 535BAAC size A; Ratings: 16V; Tolerance: ±10%; Material: Tantalum; Supplier 1: Digi-Key; Supplier Part Number 1: 718-1148-1-ND
C26-C31 C33 C35-C37 C40 C42 = CAPC_100n_0603_X7R_50V_10%: as C1 on sheet MCU1; Manufacturer 2: TDK Corporation; Manufacturer Part Number 2: C1608X7R1H104K; Package / Case: 0603 (1608 Metric); Tolerance: ±10%; Supplier 1: Digi-Key; Supplier Part Number 1: 478-5052-1-ND; ComponentLink1URL: http://www.avx.com/docs/Catalogs/cx7r.pdf; ComponentLink1Description: http://www.avx.com/docs/Catalogs/cx7r.pdf; Supplier 2: Digi-Key; Supplier Part Number 2: 445-1314-1-ND; ComponentLink2URL: http://product.tdk.com/capacitor/mlcc/en/documents/mlcc_commercial_general_en.pdf; ComponentLink2Description: http://product.tdk.com/capacitor/mlcc/en/documents/mlcc_commercial_general_en.pdf
C32 = CAPC_100n_0603_X7R_50V_10%: Capacitor SMD Cer 10nF 10% 50V X7R 0603; Manufacturer 1: AVX Corporation; Manufacturer Part Number 1: 06035C104KAT2A; Ratings: 50V; X7R; Material: ceramic; SCDType: spec; Manufacturer 2: TDK Corporation; Manufacturer Part Number 2: C1608X7R1H104K; Package / Case: 0603 (1608 Metric); Tolerance: ±10%; Supplier 1: Digi-Key; Supplier Part Number 1: 478-5052-1-ND; ComponentLink1URL: http://www.avx.com/docs/Catalogs/cx7r.pdf; ComponentLink1Description: http://www.avx.com/docs/Catalogs/cx7r.pdf; Supplier 2: Digi-Key; Supplier Part Number 2: 445-1314-1-ND; ComponentLink2URL: http://product.tdk.com/capacitor/mlcc/en/documents/mlcc_commercial_general_en.pdf; ComponentLink2Description: http://product.tdk.com/capacitor/mlcc/en/documents/mlcc_commercial_general_en.pdf
C34 = CAPT_4u7_3216_16V: Capacitor SMD Tantalum 4.7uF 10% 16V 3216-18; Manufacturer 1: Vishay/Sprague; Manufacturer Part Number 1: 293D475X9016A2TE3; SCDType: undef; Package / Case: EIA 535BAAC size A; Ratings: 16V; Tolerance: ±10%; Material: Tantalum; Supplier 1: Digi-Key; Supplier Part Number 1: 718-1148-1-ND
C38 = CAPC_100n_0603_X7R_50V_10%: Capacitor SMD Cer 6.8 10% 50V X7R 0603; Manufacturer 1: AVX Corporation; Manufacturer Part Number 1: 06035C104KAT2A; Ratings: 50V; X7R; Material: ceramic; SCDType: spec; Manufacturer 2: TDK Corporation; Manufacturer Part Number 2: C1608X7R1H104K; Package / Case: 0603 (1608 Metric); Tolerance: ±10%; Supplier 1: Digi-Key; Supplier Part Number 1: 478-5052-1-ND; ComponentLink1URL: http://www.avx.com/docs/Catalogs/cx7r.pdf; ComponentLink1Description: http://www.avx.com/docs/Catalogs/cx7r.pdf; Supplier 2: Digi-Key; Supplier Part Number 2: 445-1314-1-ND; ComponentLink2URL: http://product.tdk.com/capacitor/mlcc/en/documents/mlcc_commercial_general_en.pdf; ComponentLink2Description: http://product.tdk.com/capacitor/mlcc/en/documents/mlcc_commercial_general_en.pdf
C39 = CAPC_100n_0603_X7R_50V_10%: Capacitor SMD Cer 6.8nf 10% 50V X7R 0603; Manufacturer 1: AVX Corporation; Manufacturer Part Number 1: 06035C104KAT2A; Ratings: 50V; X7R; Material: ceramic; SCDType: spec; Manufacturer 2: TDK Corporation; Manufacturer Part Number 2: C1608X7R1H104K; Package / Case: 0603 (1608 Metric); Tolerance: ±10%; Supplier 1: Digi-Key; Supplier Part Number 1: 478-5052-1-ND; ComponentLink1URL: http://www.avx.com/docs/Catalogs/cx7r.pdf; ComponentLink1Description: http://www.avx.com/docs/Catalogs/cx7r.pdf; Supplier 2: Digi-Key; Supplier Part Number 2: 445-1314-1-ND; ComponentLink2URL: http://product.tdk.com/capacitor/mlcc/en/documents/mlcc_commercial_general_en.pdf; ComponentLink2Description: http://product.tdk.com/capacitor/mlcc/en/documents/mlcc_commercial_general_en.pdf
C41 = CAPC_100n_0603_X7R_50V_10%: Capacitor SMD Cer 1nF 10% 2kv X7R 0603; Manufacturer 1: AVX Corporation; Manufacturer Part Number 1: 06035C104KAT2A; Ratings: 50V; X7R; Material: ceramic; SCDType: spec; Manufacturer 2: TDK Corporation; Manufacturer Part Number 2: C1608X7R1H104K; Package / Case: 0603 (1608 Metric); Tolerance: ±10%; Supplier 1: Digi-Key; Supplier Part Number 1: 478-5052-1-ND; ComponentLink1URL: http://www.avx.com/docs/Catalogs/cx7r.pdf; ComponentLink1Description: http://www.avx.com/docs/Catalogs/cx7r.pdf; Supplier 2: Digi-Key; Supplier Part Number 2: 445-1314-1-ND; ComponentLink2URL: http://product.tdk.com/capacitor/mlcc/en/documents/mlcc_commercial_general_en.pdf; ComponentLink2Description: http://product.tdk.com/capacitor/mlcc/en/documents/mlcc_commercial_general_en.pdf
FB3 = FERRITE_2K2-100MHz_0603: as FB1 on sheet MCU1; Size / Dimension: 0.063" L x 0.031" W (1.60mm x 0.80mm); Current Rating: 200mA; Package / Case: 0603 (1608 Metric); Height (Max): 0.037" (0.95mm); Mounting Type: Surface Mount; Supplier 1: Digi-Key; Supplier Part Number 1: 445-8671-1-ND; RoHS 1: RoHS Compliant; ComponentLink1URL: http://www.tdk.co.jp/tefe02/e9412_mmz.pdf; ComponentLink1Description: http://www.tdk.co.jp/tefe02/e9412_mmz.pdf; Value: 2K2 @ 100 MHz
J5 = JUMP1: SMD jumper
J6-J8 = JUMP_3WAY: SMD jumper
J9 = RJ45_HR911105A: RJ45, 10/100BASE, G/Y LED; MANF: Hanrun; MANF_P#: HR911105A; PARAM2: 10/100BASE, G/Y LED; VALUE: RJ45_10/100BASE
Q7 = NPN: NPN Bipolar Transistor; Published: 8-Jun-2000; LatestRevisionDate: 17-Jul-2002; LatestRevisionNote: Re-released for DXP Platform.; PackageReference: TO-226-AA; Publisher: Altium Limited; PackageDescription: TO, Flat Index; 3 In-Line, Axial Leads; Body Dia. 4.8mm; Leads 0.55 x 0.51 mm (max); Code_JEDEC: TO-226-AA
R28 = RES_4K7_0603_5%: Resistor SMD chip 12.4K Ohm 0.1W 1% 0603; Manufacturer 1: Vishay/Dale; Manufacturer Part Number 1: CRCW06034K70JNEA; Ratings: 1/10 W; Tolerance: ±5%; SCDType: spec; Package / Case: 0603 (1608 metric); Material: Thick Film; Supplier 1: Digi-Key; Supplier Part Number 1: 541-4.7KGCT-ND
R31-R34 = RES_4K7_0603_5%: Resistor SMD chip 33 Ohm 0.1W 5% 0603; Manufacturer 1: Vishay/Dale; Manufacturer Part Number 1: CRCW06034K70JNEA; Ratings: 1/10 W; SCDType: spec; Package / Case: 0603 (1608 metric); Tolerance: ±5%; Material: Thick Film; Supplier 1: Digi-Key; Supplier Part Number 1: 541-4.7KGCT-ND
R35-R38 = RES_4K7_0603_5%: Resistor SMD chip 49 Ohm 0.1W 5% 0603; Manufacturer 1: Vishay/Dale; Manufacturer Part Number 1: CRCW06034K70JNEA; Ratings: 1/10 W; SCDType: spec; Package / Case: 0603 (1608 metric); Tolerance: ±5%; Material: Thick Film; Supplier 1: Digi-Key; Supplier Part Number 1: 541-4.7KGCT-ND
R39 = RES_4K7_0603_5%: Resistor SMD chip 10 Ohm 0.1W 5% 0603; Manufacturer 1: Vishay/Dale; Manufacturer Part Number 1: CRCW06034K70JNEA; Ratings: 1/10 W; SCDType: spec; Package / Case: 0603 (1608 metric); Tolerance: ±5%; Material: Thick Film; Supplier 1: Digi-Key; Supplier Part Number 1: 541-4.7KGCT-ND
R40-R43 = RES_4K7_0603_5%: as R1 on sheet MCU1; Package / Case: 0603 (1608 metric); Tolerance: ±5%; Material: Thick Film; Supplier 1: Digi-Key; Supplier Part Number 1: 541-4.7KGCT-ND
U5 = W5500: Socket Contact Silver 17-20 AWG Crimp Power; MF: WIZnet; Price: None; Package: LQFP-48 WIZnet; Value: *; MP: W5500; Availability: Unavailable; SnapEDA_Link: https://www.snapeda.com/parts/W5500/WIZnet/view-part/45250/?ref=snap
Y3 = OSC_4_25MHz_3225E: CLOCK OSCILLATOR, 25MHz, 10PPM, 3.2X2.5mm; MANF: ECS; PARAM: 10PPM, 15pF, -40~85oC; DESC: DESCRIPTION; DIST#: MOUSER; PARAM2: 1.8~3.3V; MANF_P#: ECS-3225S18-250-FN-TR; ASSEMBLY: ASSEMBLY; PRICE: 1= 1.2$; Value: OSC_25MHz
R29 R30 = Resistor Array SMD: DatasheetVersion: 2021; ComponentLink1Description: Website Smart World; ComponentLink1URL: https://www.smartw.ir/; ComponentLink2Description: Telegram; ComponentLink2URL: https://t.me/altium_smartw; ComponentLink3Description: Instagram; ComponentLink3URL: https://Instagram.com/smartgw.ir

## Sheet MCU3.SchDoc
size A3; SheetNumber: 4; SheetTotal: 8
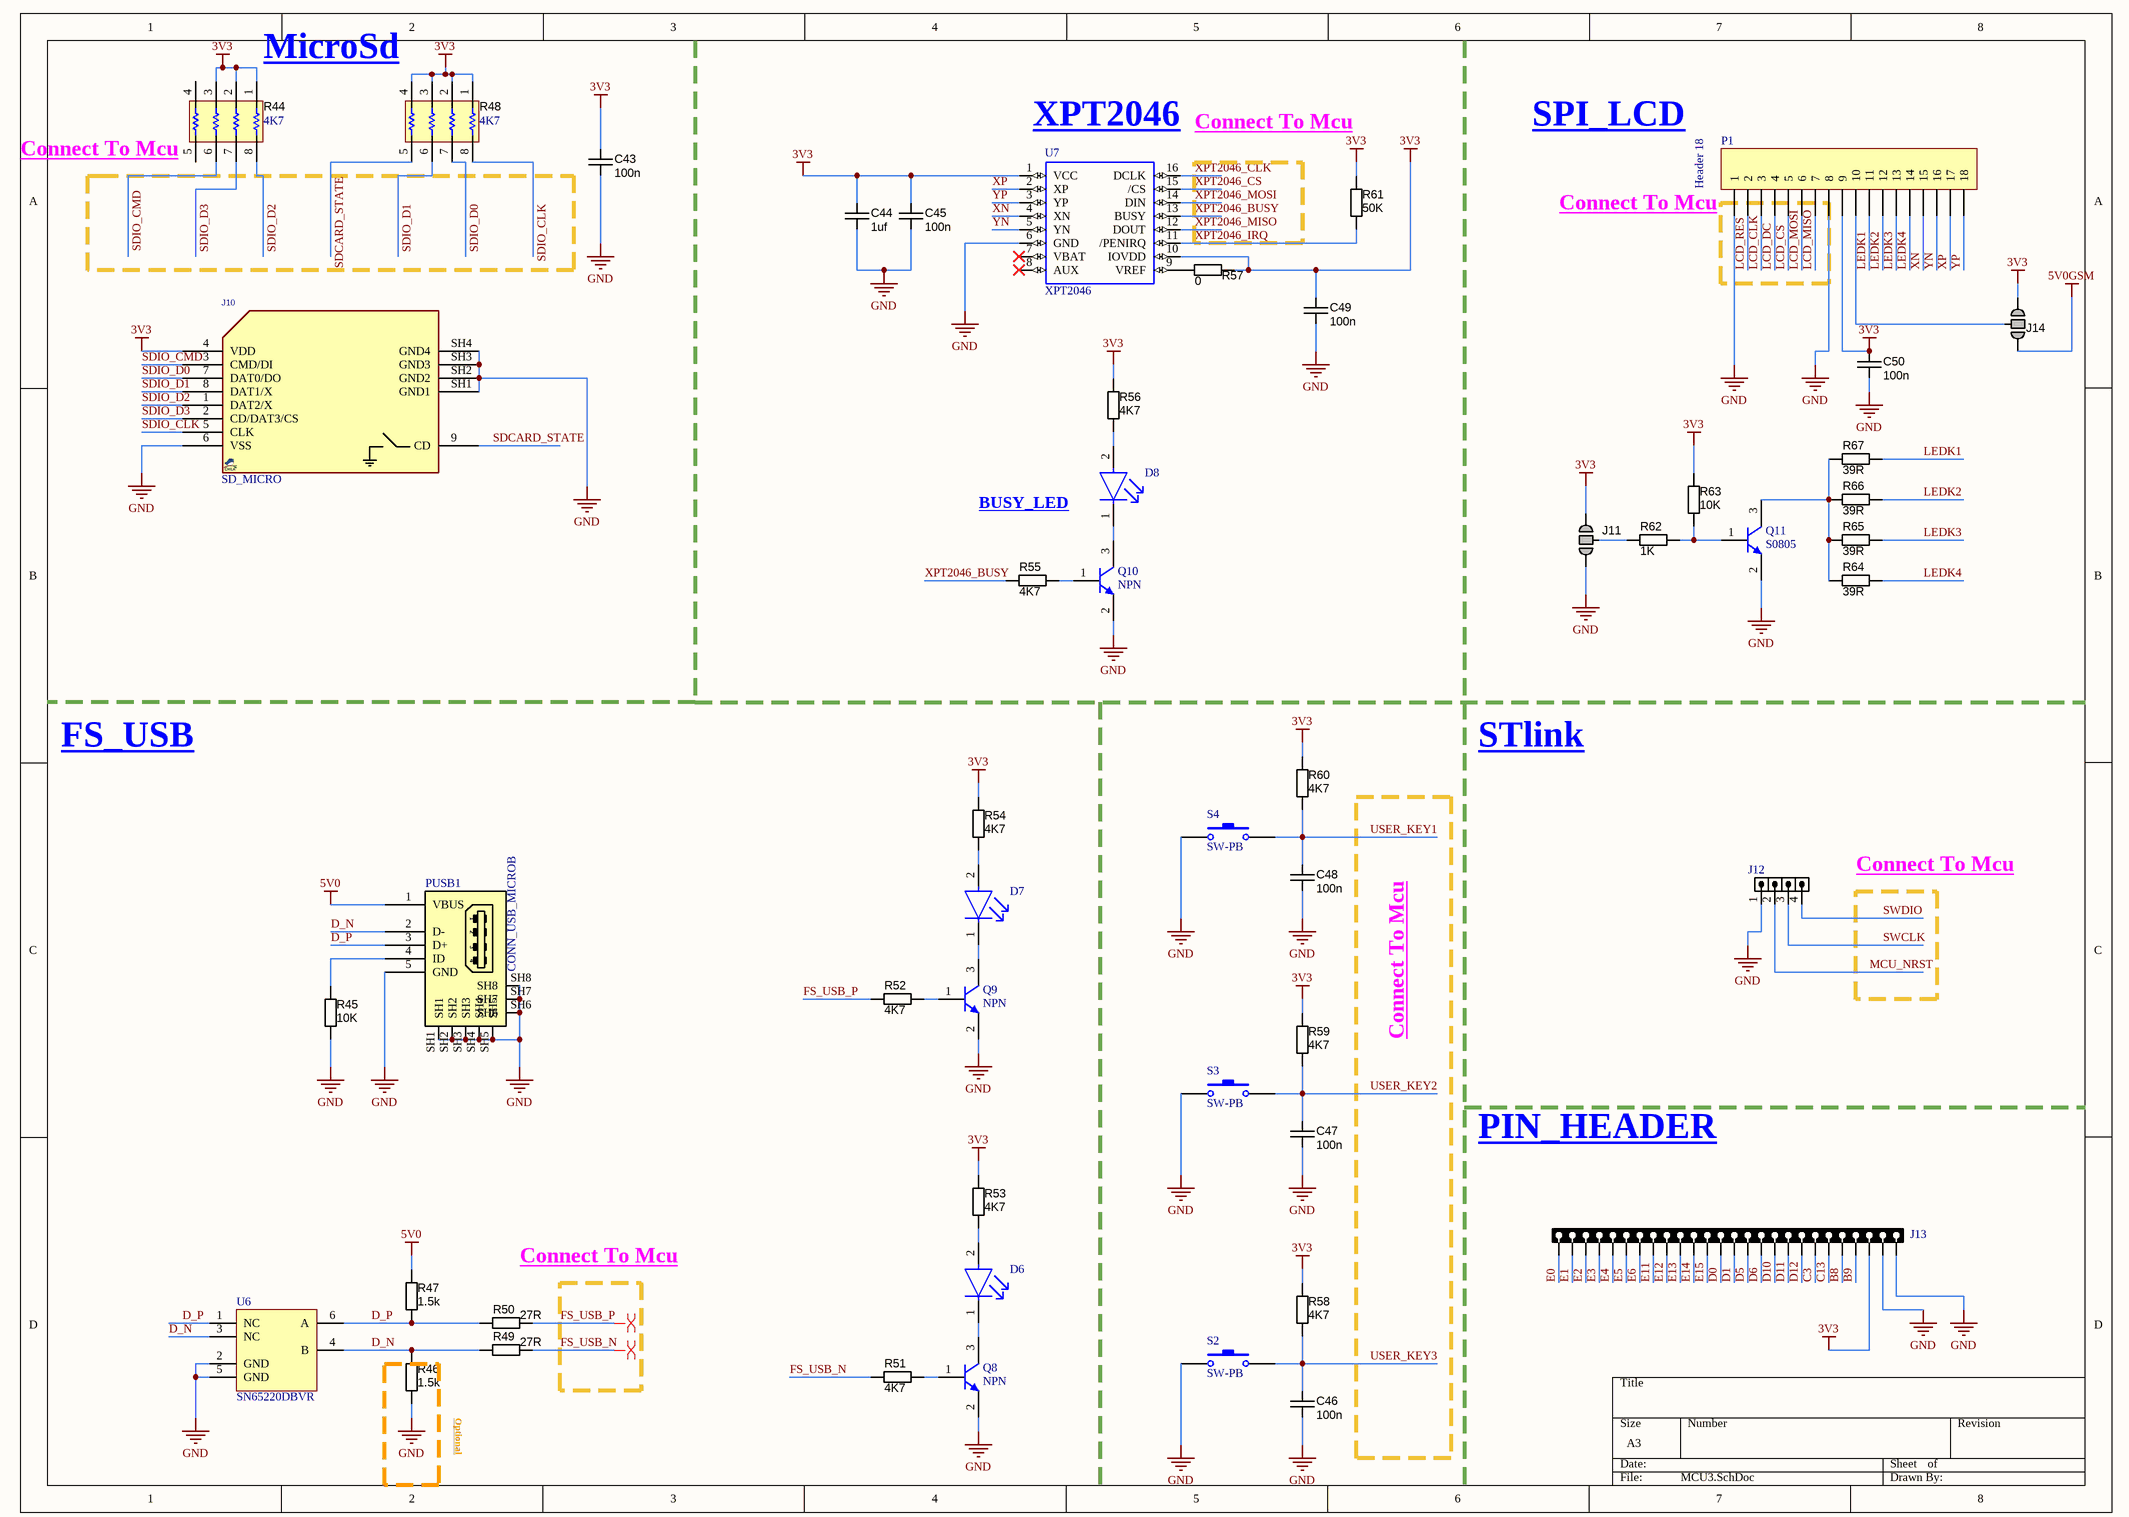
[diagram p3: MCU3.SchDoc]

### Parts
C43  value 100n  [CAPC1608X90N]  (hidden comment: approved sub OK)
C44  1uf  [CAPC3216X180N]
C45  value 100n  [CAPC1608X90N]  (hidden comment: approved sub OK)
C46  value 100n  [CAPC1608X90N]  (hidden comment: approved sub OK)
C47  value 100n  [CAPC1608X90N]  (hidden comment: approved sub OK)
C48  value 100n  [CAPC1608X90N]  (hidden comment: approved sub OK)
C49  value 100n  [CAPC1608X90N]  (hidden comment: approved sub OK)
C50  value 100n  [CAPC1608X90N]  (hidden comment: approved sub OK)
D6  LTST-C191TBKT  [FP-LTST-C191TBKT-MFG]  (value not drawn)
D7  LTST-C191TBKT  [FP-LTST-C191TBKT-MFG]  (value not drawn)
D8  LTST-C191TBKT  [FP-LTST-C191TBKT-MFG]  (value not drawn)
J10  SD_MICRO  [SDMICRO_AT]
J11  Jumper  [Jump_3Way]  (value not drawn)  (no BOM)
J12  HDR1X4  [HDR1X4_2.54mmp]  (value not drawn)
J13  HDRF26  [HDR 1X26]  (value not drawn)
J14  Jumper  [Jump_3Way]  (value not drawn)  (no BOM)
P1  Header 18  [SPI_LCD_18Pin]
PUSB1  CONN_USB_MICROB  [USB_MICRO_B_BM_SHS]
Q8  NPN  [SOT23-3]
Q9  NPN  [SOT23-3]
Q10  NPN  [SOT23-3]
Q11  S0805  [SOT23-3]
R44  value 4K7  [RP0603X4]  (hidden comment: Resistor Array SMD)
R45  value 10K  [RESC1608X55N]  (hidden comment: Thick Film)
R46  value 1.5k  [RESC1608X55N]  (hidden comment: Thick Film)
R47  value 1.5k  [RESC1608X55N]  (hidden comment: Thick Film)
R48  value 4K7  [RP0603X4]  (hidden comment: Resistor Array SMD)
R49  value 27R  [RESC1608X55N]  (hidden comment: Thick Film)
R50  value 27R  [RESC1608X55N]  (hidden comment: Thick Film)
R51  value 4K7  [RESC1608X55N]  (hidden comment: Thick Film)
R52  value 4K7  [RESC1608X55N]  (hidden comment: Thick Film)
R53  value 4K7  [RESC1608X55N]  (hidden comment: Thick Film)
R54  value 4K7  [RESC1608X55N]  (hidden comment: Thick Film)
R55  value 4K7  [RESC1608X55N]  (hidden comment: Thick Film)
R56  value 4K7  [RESC1608X55N]  (hidden comment: Thick Film)
R57  value 0  [RESC1608X55N]  (hidden comment: Thick Film)
R58  value 4K7  [RESC1608X55N]  (hidden comment: Thick Film)
R59  value 4K7  [RESC1608X55N]  (hidden comment: Thick Film)
R60  value 4K7  [RESC1608X55N]  (hidden comment: Thick Film)
R61  value 50K  [RESC1608X55N]  (hidden comment: Thick Film)
R62  value 1K  [RESC1608X55N]  (hidden comment: Thick Film)
R63  value 10K  [RESC1608X55N]  (hidden comment: Thick Film)
R64  value 39R  [RESC1608X55N]  (hidden comment: Thick Film)
R65  value 39R  [RESC1608X55N]  (hidden comment: Thick Film)
R66  value 39R  [RESC1608X55N]  (hidden comment: Thick Film)
R67  value 39R  [RESC1608X55N]  (hidden comment: Thick Film)
S2  SW-PB  [SWPBS_SPST_6X3X5]
S3  SW-PB  [SWPBS_SPST_6X3X5]
S4  SW-PB  [SWPBS_SPST_6X3X5]
U6  SN65220DBVR  [DBV0006A_M]
U7  XPT2046  [TSSOP16]

### Nets
3V3: C43.1 C44.1 C45.1 C49.1 C50.1 J10.4(VDD) J11.3 J13.24 J14.1 P1.9 R44.1 R44.2 R44.3 R48.1 R48.2 R48.3 R48.4 R53.2 R54.2 R56.2 R57.1 R58.1 R59.1 R60.1 R61.1 R63.2 U7.1(VCC) U7.10(IOVDD)
5V0: PUSB1.1(VBUS) R47.1
5V0GSM: J14.3
GND: C43.2 C44.2 C45.2 C46.2 C47.2 C48.2 C49.2 C50.2 J10.6(VSS) J10.SH1(GND1) J10.SH2(GND2) J10.SH3(GND3) J10.SH4(GND4) J11.1 J12.1 J13.25 J13.26 P1.1 P1.8 PUSB1.5(GND) PUSB1.SH1 PUSB1.SH2 PUSB1.SH3 PUSB1.SH4 PUSB1.SH5 PUSB1.SH6 PUSB1.SH7 PUSB1.SH8 Q8.2(E) Q9.2(E) Q10.2(E) Q11.2(E) R45.1 R46.2 S2.2 S3.2 S4.2 U6.2(GND) U6.5(GND) U7.6(GND)
B8: J13.22
B9: J13.23
C3: J13.20
C13: J13.21
D0: J13.13
D1: J13.14
D5: J13.15
D6: J13.16
D10: J13.17
D11: J13.18
D12: J13.19
D_N: PUSB1.2(D-) R46.1 R49.1 U6.3(NC) U6.4(B)
D_P: PUSB1.3(D+) R47.2 R50.1 U6.1(NC) U6.6(A)
E0: J13.1
E1: J13.2
E2: J13.3
E3: J13.4
E4: J13.5
E5: J13.6
E6: J13.7
E11: J13.8
E12: J13.9
E13: J13.10
E14: J13.11
E15: J13.12
FS_USB_N: R49.2 R51.1
FS_USB_P: R50.2 R52.1
LCD_CLK: P1.3
LCD_CS: P1.5
LCD_DC: P1.4
LCD_MISO: P1.7
LCD_MOSI: P1.6
LCD_RES: P1.2
LEDK1: P1.11 R67.2
LEDK2: P1.12 R66.2
LEDK3: P1.13 R65.2
LEDK4: P1.14 R64.2
MCU_NRST: J12.2
SDCARD_STATE: J10.9(CD) R48.5
SDIO_CLK: J10.5(CLK) R48.8
SDIO_CMD: J10.3(CMD/DI) R44.6
SDIO_D0: J10.7(DAT0/DO) R48.7
SDIO_D1: J10.8(DAT1/X) R48.6
SDIO_D2: J10.1(DAT2/X) R44.8
SDIO_D3: J10.2(CD/DAT3/CS) R44.7
SWCLK: J12.3
SWDIO: J12.4
USER_KEY1: C48.1 R60.2 S4.1
USER_KEY2: C47.1 R59.2 S3.1
USER_KEY3: C46.1 R58.2 S2.1
XN: P1.15 U7.4(XN)
XP: P1.17 U7.2(XP)
XPT2046_BUSY: R55.1 U7.13(BUSY)
XPT2046_CLK: U7.16(DCLK)  [project net W25Q_CLK]
XPT2046_CS: U7.15(/CS)
XPT2046_IRQ: R61.2 U7.11(/PENIRQ)
XPT2046_MISO: U7.12(DOUT)  [project net W25Q_MISO]
XPT2046_MOSI: U7.14(DIN)  [project net W25Q_MOSI]
YN: P1.16 U7.5(YN)
YP: P1.18 U7.3(YP)
NetD6_1: D6.1(C) Q8.3(C)
NetD6_2: D6.2(A) R53.1
NetD7_1: D7.1(C) Q9.3(C)
NetD7_2: D7.2(A) R54.1
NetD8_1: D8.1(C) Q10.3(C)
NetD8_2: D8.2(A) R56.1
NetJ11_2: J11.2 R62.2
NetJ14_2: J14.2 P1.10
NetPUSB1_4: PUSB1.4(ID) R45.2
NetQ8_1: Q8.1(B) R51.2
NetQ9_1: Q9.1(B) R52.2
NetQ10_1: Q10.1(B) R55.2
NetQ11_1: Q11.1(B) R62.1 R63.1
NetQ11_3: Q11.3(C) R64.1 R65.1 R66.1 R67.1
NetR57_2: R57.2 U7.9(VREF)

Not connected (* = marked no-connect by the designer): R44 4 5; U7 7(VBAT)* 8(AUX)*

### Layout directives
differential pair: FS_USB_N, FS_USB_P

### Notes on the sheet
- MicroSd
- (near R44) Connect To Mcu
- (near U7) XPT2046
- Connect To Mcu
- SPI_LCD
- (near P1) Connect To Mcu
- BUSY_LED
- FS_USB
- STlink
- PIN_HEADER
- Optional

### Library data of the parts
C43 C45-C50 = CAPC_100n_0603_X7R_50V_10%: as C1 on sheet MCU1; Manufacturer 2: TDK Corporation; Manufacturer Part Number 2: C1608X7R1H104K; Package / Case: 0603 (1608 Metric); Tolerance: ±10%; Supplier 1: Digi-Key; Supplier Part Number 1: 478-5052-1-ND; ComponentLink1URL: http://www.avx.com/docs/Catalogs/cx7r.pdf; ComponentLink1Description: http://www.avx.com/docs/Catalogs/cx7r.pdf; Supplier 2: Digi-Key; Supplier Part Number 2: 445-1314-1-ND; ComponentLink2URL: http://product.tdk.com/capacitor/mlcc/en/documents/mlcc_commercial_general_en.pdf; ComponentLink2Description: http://product.tdk.com/capacitor/mlcc/en/documents/mlcc_commercial_general_en.pdf
C44 = CAPC_47n_1206_X7R_50V_10%: Capacitor SMD Cer 47nF 10% 50V X7R 1206; Manufacturer 1: Yageo; Manufacturer Part Number 1: CC1206KRX7R9BB473; Ratings: 50V; X7R; SCDType: spec; Package / Case: 1206 (3216 Metric); Tolerance: ±10%; Operating Temperature: -55°C ~ 125°C; Size / Dimension: 0.126" L x 0.063" W (3.20mm x 1.60mm); Supplier 1: Digi-Key; Voltage - Rated: 50V; Supplier Part Number 1: 311-1178-1-ND; Value: 1uf
D6-D8 = CMP-22017-000008-1: as D2 on sheet MCU1; Case Code (Metric): 1608; Packaging: Tape and Reel; Case/Package: 0603; Depth: 1.6mm; Mount: Surface Mount; Lead Free: Lead Free; Min Operating Temperature: -20°C; Lens Transparency: Clear; Illumination Color: Blue; Height: 0.55mm; Test Current: 20mA; Case Code (Imperial): 0603; Max Operating Temperature: 80°C; Number of Pins: 2; Length: 0.8mm; Radiation Hardening: No; Package Quantity: 1; Number of LEDs: 1; Width: 0.8mm; Color: Blue
J10 = SOCKET_SDMICRO_AT: SD MICRO exist in Iran, Attend 112J-TDAR-R01; PARAM: push-push; MANF: Attend; MANF_P#: 112J-TDAR-R01; VALUE: SD_MICRO
J11 J14 = JUMP_3WAY: SMD jumper
J12 = HDR_M_1X4: CONN, HEADER, Male, pitch: 2.54mm, 4POS; VALUE: HDRM4
J13 = HDR_F_1X26: CONN, HEADER, Male, pitch: 2.54mm, 26POS; Website Smart World: https://www.smartw.ir/; VALUE: HDRF26
P1 = Header 18: Header, 18-Pin; LatestRevisionDate: 17-Jul-2002; LatestRevisionNote: Re-released for DXP Platform.; Publisher: Altium Limited
PUSB1 = CONN_USB_MICRO_B_MOLEX: CONN, USB, MICRO B, R/A, SMD, BOTTOM MOUNT; MANF_P#: 47491-0001; MANF: MOLEX; VALUE: CONN_USB_MICROB
Q8-Q11 = NPN: NPN Bipolar Transistor; Published: 8-Jun-2000; LatestRevisionDate: 17-Jul-2002; LatestRevisionNote: Re-released for DXP Platform.; PackageReference: TO-226-AA; Publisher: Altium Limited; PackageDescription: TO, Flat Index; 3 In-Line, Axial Leads; Body Dia. 4.8mm; Leads 0.55 x 0.51 mm (max); Code_JEDEC: TO-226-AA
R45 R61 R63 = RES_4K7_0603_5%: Resistor SMD chip 10K Ohm 0.1W 5% 0603; Manufacturer 1: Vishay/Dale; Manufacturer Part Number 1: CRCW06034K70JNEA; Ratings: 1/10 W; SCDType: spec; Package / Case: 0603 (1608 metric); Tolerance: ±5%; Material: Thick Film; Supplier 1: Digi-Key; Supplier Part Number 1: 541-4.7KGCT-ND
R46 R47 = RES_4K7_0603_5%: Resistor SMD chip 1.5k Ohm 0.1W 5% 0603; Manufacturer 1: Vishay/Dale; Manufacturer Part Number 1: CRCW06034K70JNEA; Ratings: 1/10 W; SCDType: spec; Package / Case: 0603 (1608 metric); Tolerance: ±5%; Material: Thick Film; Supplier 1: Digi-Key; Supplier Part Number 1: 541-4.7KGCT-ND
R49 R50 = RES_4K7_0603_5%: Resistor SMD chip 27 Ohm 0.1W 5% 0603; Manufacturer 1: Vishay/Dale; Manufacturer Part Number 1: CRCW06034K70JNEA; Ratings: 1/10 W; SCDType: spec; Package / Case: 0603 (1608 metric); Tolerance: ±5%; Material: Thick Film; Supplier 1: Digi-Key; Supplier Part Number 1: 541-4.7KGCT-ND
R51-R56 R58-R60 = RES_4K7_0603_5%: as R1 on sheet MCU1; Package / Case: 0603 (1608 metric); Tolerance: ±5%; Material: Thick Film; Supplier 1: Digi-Key; Supplier Part Number 1: 541-4.7KGCT-ND
R57 = RES_4K7_0603_5%: as R2 on sheet MCU1; Package / Case: 0603 (1608 metric); Tolerance: ±5%; Material: Thick Film; Supplier 1: Digi-Key; Supplier Part Number 1: 541-4.7KGCT-ND
R62 = RES_4K7_0603_5%: Resistor SMD chip 1K Ohm 0.1W 5% 0603; Manufacturer 1: Vishay/Dale; Manufacturer Part Number 1: CRCW06034K70JNEA; Ratings: 1/10 W; SCDType: spec; Package / Case: 0603 (1608 metric); Tolerance: ±5%; Material: Thick Film; Supplier 1: Digi-Key; Supplier Part Number 1: 541-4.7KGCT-ND
R64-R67 = RES_4K7_0603_5%: Resistor SMD chip 39R Ohm 0.1W 5% 0603; Manufacturer 1: Vishay/Dale; Manufacturer Part Number 1: CRCW06034K70JNEA; Ratings: 1/10 W; SCDType: spec; Package / Case: 0603 (1608 metric); Tolerance: ±5%; Material: Thick Film; Supplier 1: Digi-Key; Supplier Part Number 1: 541-4.7KGCT-ND
S2-S4 = SW-PB: Switch; Published: 24-Mar-1999; LatestRevisionDate: 17-Jul-2002; LatestRevisionNote: Re-released for DXP Platform.; PackageReference: SPST-2; Publisher: Altium Limited; PackageDescription: Switch; 2 Leads
U6 = CMP-0326-00064-3: Single Universal Serial Bus Port Transient Suppressor, 2 Channels, -40 to +85 degC, 6-pin SOT-23 (DBV), Green (RoHS & no Sb/Br); Manufacturer: Texas Instruments; IO Leakage Current(nA): 1000; Breakdown Voltage(Min)(V): 7; SubFamily: ESD Solution; USB Full Speed: TRUE; IO Capacitance(Typ)(pF): 35; ComponentLink1URL: http://www.ti.com/; PackageVersion: revK, Mar-2006; Mounting Technology: Surface Mount; ComponentLink2URL: http://www.ti.com/general/docs/lit/getliterature.tsp?genericPartNumber=SN65220&fileType=pdf; PackageDescription: 6-Pin Plastic Small-Outline Package, 2.9 x 1.6 mm Body, 0.95 mm Pitch, 2.8 mm Lead Span; PackageReference: DBV0006A; Eco-Plan: Green (RoHS & no Sb/Br); ComponentLink3Description: URL Link1; ComponentLink2Description: Datasheet; ComponentLink1Description: Manufacturer URL; DatasheetVersion: SLLS266G; PartNumber: SN65220DBVR; ComponentLink3URL: SamplesURL:http://www.ti.com/product/sn65220#samples
U7 = XPT2046: RASPBERRY PI 3.5 TFT DISPLAY; MF: Xptek; Value: *; Package: Package; Availability: Unavailable; SnapEDA_Link: https://www.snapeda.com/parts/XPT2046/Xptek/view-part/5164510/?ref=snap; MP: XPT2046; Price: None; Check_prices: https://www.snapeda.com/parts/XPT2046/Xptek/view-part/5164510/?ref=eda
R44 R48 = Resistor Array SMD: DatasheetVersion: 2021; ComponentLink1Description: Website Smart World; ComponentLink1URL: https://www.smartw.ir/; ComponentLink2Description: Telegram; ComponentLink2URL: https://t.me/altium_smartw; ComponentLink3Description: Instagram; ComponentLink3URL: https://Instagram.com/smartgw.ir